# EAGLE design bombclock_1.2 (EAGLE 7.3.0)
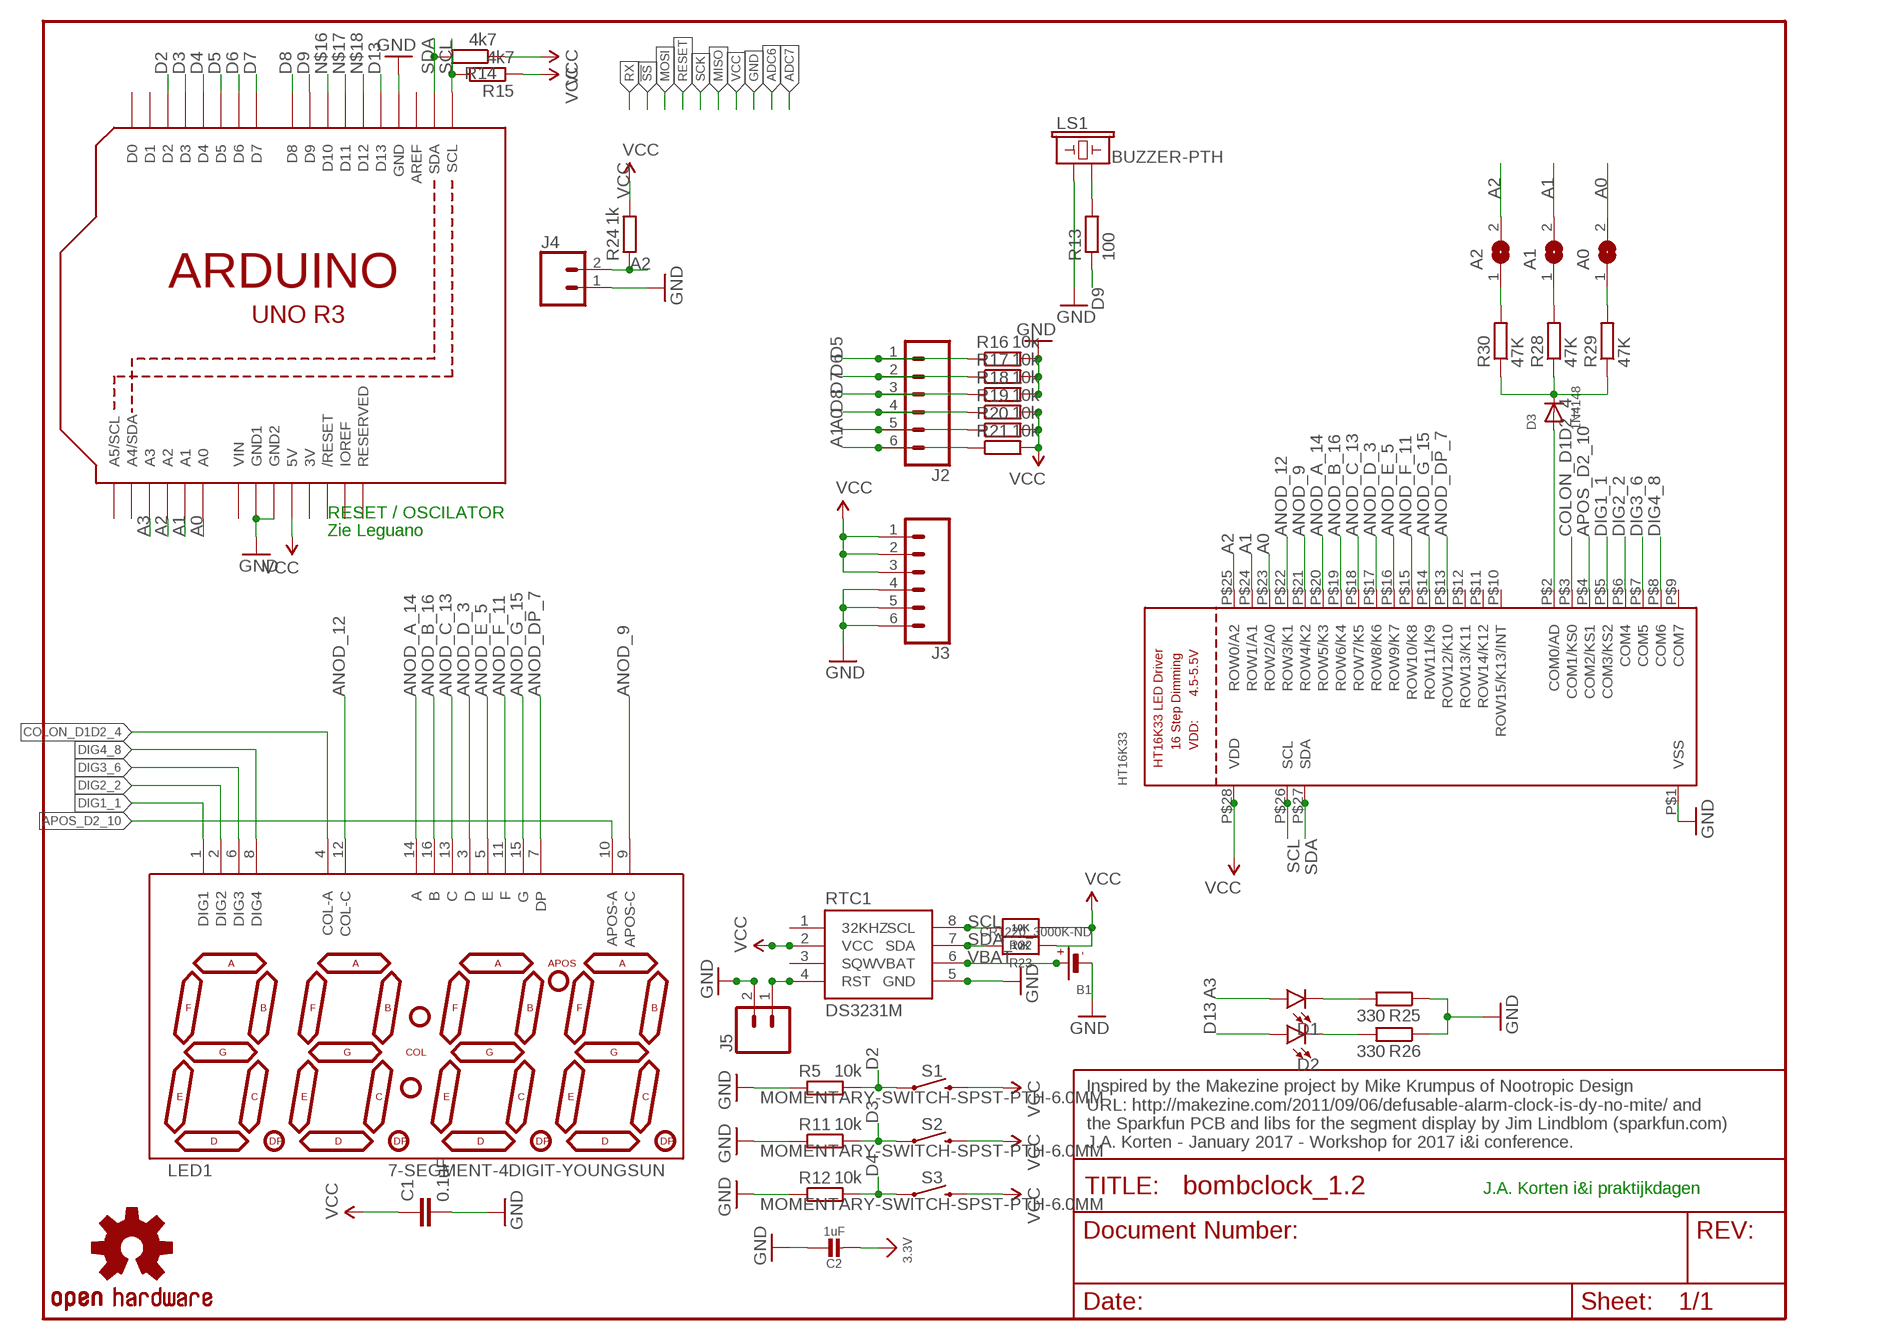
[diagram p0: schematic, sheet 1]

## Parts
A0  SOLDERJUMPERREFLOW_NOPASTE  [SOLDERJUMPER_REFLOW_NOPASTE]
A1  SOLDERJUMPERREFLOW_NOPASTE  [SOLDERJUMPER_REFLOW_NOPASTE]
A2  SOLDERJUMPERREFLOW_NOPASTE  [SOLDERJUMPER_REFLOW_NOPASTE]
B1  CR1220_3000K-ND  BATTERYCR1220_SMT  [CR1220]
C1  0.1uF  CAP0402-CAP  [0402-CAP]
C2  1uF  CAP_CERAMIC0805-NOOUTLINE  [0805-NO]
D1  LED5MM  [LED_5MM]
D2  LED5MM  [LED_5MM]
D3  1N4148  DIODESOD-323F  [SOD-323F]
HT16K33  HT16K33_SOP28  [SOP28_300MIL]
J2  CONN_06SILK_FEMALE_PTH  [1X06]
J3  CONN_06SILK_FEMALE_PTH  [1X06]
J4  CONN_02  [1X02]
J5  CONN_02  [1X02]
LED1  7-SEGMENT-4DIGIT-YOUNGSUN  [7-SEGMENT-4DIGIT-YOUNGSUN]
LS1  BUZZER-PTH  [BUZZER-12MM]
R5  10k  R-EU_R0603  [R0603]
R11  10k  R-EU_R0603  [R0603]
R12  10k  R-EU_R0603  [R0603]
R13  100  R-EU_R0603  [R0603]
R14  4k7  R-EU_R0603  [R0603]
R15  4k7  R-EU_R0603  [R0603]
R16  10k  R-EU_R0603  [R0603]
R17  10k  R-EU_R0603  [R0603]
R18  10k  R-EU_R0603  [R0603]
R19  10k  R-EU_R0603  [R0603]
R20  10k  R-EU_R0603  [R0603]
R21  10k  R-EU_R0603  [R0603]
R22  10K  RESISTOR0805_NOOUTLINE  [0805-NO]
R23  10K  RESISTOR0805_NOOUTLINE  [0805-NO]
R24  1k  R-EU_R0603  [R0603]
R25  330  R-EU_R0603  [R0603]
R26  330  R-EU_R0603  [R0603]
R28  47K  R-EU_R0603  [R0603]
R29  47K  R-EU_R0603  [R0603]
R30  47K  R-EU_R0603  [R0603]
RTC1  DS3231M  [SO08]
S1  MOMENTARY-SWITCH-SPST-PTH-6.0MM  [TACTILE_SWITCH_PTH_6.0MM]
S2  MOMENTARY-SWITCH-SPST-PTH-6.0MM  [TACTILE_SWITCH_PTH_6.0MM]
S3  MOMENTARY-SWITCH-SPST-PTH-6.0MM  [TACTILE_SWITCH_PTH_6.0MM]
U1  ARDUINOR3-DIMENSION  [ARDUINOR3]
U$4  OSHW-LOGOS  [OSHW-LOGO-S]

## Nets
3.3V: C2.2
A0: A0.2 HT16K33.P$23(ROW2/A0) J2.5 R20.1 U1.A0
A1: A1.2 HT16K33.P$24(ROW1/A1) J2.6 R21.1 U1.A1
A2: A2.2 HT16K33.P$25(ROW0/A2) J4.2 R24.1 U1.A2
A3: D1.A U1.A3
ANOD_9: HT16K33.P$21(ROW4/K2) LED1.9(APOS-C)
ANOD_12: HT16K33.P$22(ROW3/K1) LED1.12(COL-C)
ANOD_A_14: HT16K33.P$20(ROW5/K3) LED1.14(A)
ANOD_B_16: HT16K33.P$19(ROW6/K4) LED1.16(B)
ANOD_C_13: HT16K33.P$18(ROW7/K5) LED1.13(C)
ANOD_D_3: HT16K33.P$17(ROW8/K6) LED1.3(D)
ANOD_DP_7: HT16K33.P$13(ROW12/K10) LED1.7(DP)
ANOD_E_5: HT16K33.P$16(ROW9/K7) LED1.5(E)
ANOD_F_11: HT16K33.P$15(ROW10/K8) LED1.11(F)
ANOD_G_15: HT16K33.P$14(ROW11/K9) LED1.15(G)
APOS_D2_10: HT16K33.P$4(COM2/KS1) LED1.10(APOS-A)
COLON_D1D2_4: HT16K33.P$3(COM1/KS0) LED1.4(COL-A)
D2: R5.2 S1.1 U1.D2
D3: R11.2 S2.1 U1.D3
D4: R12.2 S3.1 U1.D4
D5: J2.1 R16.1 U1.D5
D6: J2.2 R17.1 U1.D6
D7: J2.3 R18.1 U1.D7
D8: J2.4 R19.1 U1.D8
D9: R13.1 U1.D9
D13: D2.A U1.D13
DIG1_1: HT16K33.P$5(COM3/KS2) LED1.1(DIG1)
DIG2_2: HT16K33.P$6(COM4) LED1.2(DIG2)
DIG3_6: HT16K33.P$7(COM5) LED1.6(DIG3)
DIG4_8: HT16K33.P$8(COM6) LED1.8(DIG4)
GND: B1.- C1.2 C2.1 HT16K33.P$1(VSS) J3.4 J3.5 J3.6 J4.1 J5.2 LS1.+ R5.1 R11.1 R12.1 R16.2 R17.2 R18.2 R25.1 R26.1 RTC1.5(GND) U1.GND U1.GND1 U1.GND2
N$1: A0.1 R29.2
N$7: D3.A HT16K33.P$2(COM0/AD)
N$12: D1.K(C) R25.2
N$14: D2.K(C) R26.2
N$16: U1.D10
N$17: U1.D11
N$18: U1.D12
N$19: A1.1 R28.2
N$20: LS1.- R13.2
N$28: D3.C R28.1 R29.1 R30.1
N$29: A2.1 R30.2
PP: J5.1 RTC1.4(RST)
SCL: HT16K33.P$26(SCL) R15.2 R22.2 RTC1.8(SCL) U1.SCL
SDA: HT16K33.P$27(SDA) R14.2 R23.2 RTC1.7(SDA) U1.SDA
VBAT: B1.+$1(+) RTC1.6(VBAT)
VCC: C1.1 HT16K33.P$28(VDD) J3.1 J3.2 J3.3 R14.1 R15.1 R19.2 R20.2 R21.2 R22.1 R23.1 R24.2 RTC1.2(VCC) S1.3 S2.3 S3.3 U1.5V
Unconnected: HT16K33.P$9(COM7) HT16K33.P$10(ROW15/K13/INT) HT16K33.P$11(ROW14/K12) HT16K33.P$12(ROW13/K11) RTC1.1(32KHZ) RTC1.3(SQW) U1.A4(A4/SDA) U1.A5(A5/SCL) U1.AREF U1.D0 U1.D1 U1.IOREF U1.RESERVED U1.RESET(/RESET)

## Notes on the sheet
- RESET / OSCILATOR
- Zie Leguano
- Inspired by the Makezine project by Mike Krumpus of Nootropic Design 
  URL: http://makezine.com/2011/09/06/defusable-alarm-clock-is-dy-no-mite/ and 
  the Sparkfun PCB and libs for the segment display by Jim Lindblom (sparkfun.com)
  J.A. Korten - January 2017 - Workshop for 2017 i&i conference.
- J.A. Korten i&i praktijkdagen

## Power pins joined to a net without a drawn wire
3V: U1.3V
VIN: U1.VIN

## Library data of the parts
A0 A1 A2 = microbuilder:SOLDERJUMPER: SMD Solder JUMPER Solder the two pads together to create a connection, or remove the solder to break it. REFLOW - Use this footprint for solder paste and reflow ovens. WAVE - Use this footprint for hand-soldering (larger pads). CLOSED - Has a trace between the two pads to ensure it is closed by default. The trace needs to be cut to disable the jumper, and can be closed again by creating a solder bridge between the two pads.
B1 = microbuilder:BATTERY: CR1220 SMT - Digikey: 3001K-ND CD2032 BAT-HLD-001 - Digikey: BAT-HLD-001-ND
C1 = SparkFun:CAP: Capacitor Standard 0603 ceramic capacitor, and 0.1" leaded capacitor.
C2 = microbuilder:CAP_CERAMIC: Ceramic Capacitors For new designs, use the packages preceded by an '_' character since they are more reliable: The following footprints should be used on most boards: _0402 - Standard footprint for regular board layouts _0603 - Standard footprint for regular board layouts _0805 - Standard footprint for regular board layouts _1206 - Standard footprint for regular board layouts For extremely tight-pitch boards where space is at a premium, the following 'micro-pitch' footprints can be used (smaller pads, no silkscreen outline, etc.): _0402MP - Micro-pitch footprint for very dense/compact boards _0603MP - Micro-pitch footprint for very dense/compact boards _0805MP - Micro-pitch footprint for very dense/compact boards _1206MP - Micro-pitch footprint for very dense/compact boards
D1 D2 = SparkFun-LED:LED: LED (Generic) Standard schematic elements and footprints for 5mm, 3mm, 1206, and 0603 sized LEDs. Generic LEDs with no color specified.
D3 = adafruit:DIODE: Diode SMADIODE - SMA Surface Mount Package 20V 1A Schottky Diode Digikey: 641-1014-6-ND DO-1N4148 - Through Hole Small Current Diode SOD-123 20V 1 A (.5mV Vf) Schottky Diode - Digikey: MBRX120TPMSCT-ND SOD-323 10V 570mA (.38mV Vf, 3ns) Schottky Diode - Digikey: ZLLS410CT-ND SOD-523 30V 30mA Schottky Diode (RB751S-40TE61) - Digikey: RB751S-40TE61CT-ND SOT23-R/W - SOT23 Package (R = Solder Paste/Reflow Ovens, W = Hand-Soldering) BAT54Film 40V 300mA - Digikey: 497-7162-1-ND
HT16K33 = microbuilder:HT16K33_SOP28
J2 J3 = SparkFun-Connectors:CONN_06: Multi connection point. Often used as Generic Header-pin footprint for 0.1 inch spaced/style header connections On any of the 0.1 inch spaced packages, you can populate with these: Break Away Headers - Straight <https://www.sparkfun.com/products/116> (PRT-00116) Break Away Male Headers - Right Angle <https://www.sparkfun.com/products/553> (PRT-00553) Female Headers <https://www.sparkfun.com/products/115> (PRT-00115) Break Away Headers - Machine Pin <https://www.sparkfun.com/products/117> (PRT-00117) Break Away Female Headers - Swiss Machine Pin <https://www.sparkfun.com/products/743> (PRT-00743) Arduino Stackable Header - 6 Pin <https://www.sparkfun.com/products/9280> (PRT-09280) For SCREWTERMINALS and SPRING TERMINALS visit here: Screw Terimnals on SparkFun.com <https://www.sparkfun.com/search/results?term=Screw+Terminals> (5mm/3.5mm/2.54mm spacing) This device is also useful as a general connection point to wire up your design to another part of your project. Our various solder wires solder well into these plated through hole pads. Hook-Up Wire - Assortment (Stranded, 22 AWG) <https://www.sparkfun.com/products/11375> (PRT-11375) Hook-Up Wire - Assortment (Solid Core, 22 AWG) <https://www.sparkfun.com/products/11367> (PRT-11367) View the entire wire category on our website here <https://www.sparkfun.com/categories/141>; PROD_ID: CONN-08437
J4 J5 = SparkFun-Connectors:CONN_02: Multi connection point. Often used as Generic Header-pin footprint for 0.1 inch spaced/style header connections On any of the 0.1 inch spaced packages, you can populate with these: Break Away Headers - Straight <https://www.sparkfun.com/products/116> (PRT-00116) Break Away Male Headers - Right Angle <https://www.sparkfun.com/products/553> (PRT-00553) Female Headers <https://www.sparkfun.com/products/115> (PRT-00115) Break Away Headers - Machine Pin <https://www.sparkfun.com/products/117> (PRT-00117) Break Away Female Headers - Swiss Machine Pin <https://www.sparkfun.com/products/743> (PRT-00743) For SCREWTERMINALS and SPRING TERMINALS visit here: Screw Terimnals on SparkFun.com <https://www.sparkfun.com/search/results?term=Screw+Terminals> (5mm/3.5mm/2.54mm spacing) This device is also useful as a general connection point to wire up your design to another part of your project. Our various solder wires solder well into these plated through hole pads. Hook-Up Wire - Assortment (Stranded, 22 AWG) <https://www.sparkfun.com/products/11375> (PRT-11375) Hook-Up Wire - Assortment (Solid Core, 22 AWG) <https://www.sparkfun.com/products/11367> (PRT-11367) View the entire wire category on our website here <https://www.sparkfun.com/categories/141> Special notes: Molex polarized connector foot print use with: PRT-08233 with associated crimp pins and housings. 2.54_SCREWTERM for use with PRT-10571. 3.5mm Screw Terminal footprints for PRT-08084 5mm Screw Terminal footprints for use with PRT-08432
LED1 = SparkFun:7-SEGMENT-4DIGIT-YOUNGSUN: This is a part for the 4-Digit 7-segment LEDs from Young Sun. Different from the Digikey LEDs, all 16 pins are used. The LONGPADS Variant is used for a test jig, but you may like it because there is more pad to solder to. If you are concerned about routing space, the standard works just fine though.
LS1 = SparkFun-Electromechanical:BUZZER: Buzzer Small round buzzers that operate around the audible 2kHz range. You can use these as speakers to create simple music or user interfaces. Variant Overview: PTH - Mini Speaker - PC Mount 12mm 2.048kHz <https://www.sparkfun.com/products/7950> PTH_KIT - Mini Speaker - PC Mount 12mm 2.048kHz <https://www.sparkfun.com/products/7950> KIT simplifies soldering by adding stop mask to one side of the pads. PTH_NO_SILK - Mini Speaker - PC Mount 12mm 2.048kHz <https://www.sparkfun.com/products/7950> No silkscreen indicator of buzzer outline. PTH_KIT_NO_SILK - Mini Speaker - PC Mount 12mm 2.048kHz <https://www.sparkfun.com/products/7950> KIT package w/o silkscreen SMD - Buzzer Audio Magnetic (CCV-084B16) SMD buzzer used on, e.g. the LilyPad Buzzer <https://www.sparkfun.com/products/8463> and RFID USB Reader <https://www.sparkfun.com/products/9963>. SMD_KIT - Buzzer Audio Magnetic (CCV-084B16) SMD Buzzer with elongated pins to make soldering easier. Used on the SparkFun Simon Says - Surface Mount Soldering Kit <https://www.sparkfun.com/products/10935>.; PROD_ID: COMP-08253; SF_SKU: COM-07950
R5 R11-R21 R24-R26 = rcl:R-EU_: RESISTOR, European symbol
R22 R23 = microbuilder:RESISTOR: Resistors For new designs, use the packages preceded by an '_' character since they are more reliable: The following footprints should be used on most boards: _0402 - Standard footprint for regular board layouts _0603 - Standard footprint for regular board layouts _0805 - Standard footprint for regular board layouts _1206 - Standard footprint for regular board layouts For extremely tight-pitch boards where space is at a premium, the following 'micro-pitch' footprints can be used (smaller pads, no silkscreen outline, etc.): _0402MP - Micro-pitch footprint for very dense/compact boards _0603MP - Micro-pitch footprint for very dense/compact boards _0805MP - Micro-pitch footprint for very dense/compact boards _1206MP - Micro-pitch footprint for very dense/compact boards
R28-R30 = resistor:R-EU_: RESISTOR, European symbol
RTC1 = SparkFun-Clocks:DS3231M: DS3231M Real Time Clock Accuracy +/-5ppm. Battery Backup. 2.3V to 5.5V. Datasheet <https://cdn.sparkfun.com/datasheets/Dev/Beagle/DS3231M.pdf> SparkFun Products CryptoCape <https://www.sparkfun.com/products/12773> (DEV-12773) SparkFun CryptoShield <https://www.sparkfun.com/products/13183> (DEV-13183); PROD_ID: IC-11985
S1-S3 = SparkFun-Switches:MOMENTARY-SWITCH-SPST: Momentary Switch (Pushbutton) - SPST Normally-open (NO) SPST momentary switches (buttons, pushbuttons). Variants PTH-12MM - 12mm square, through-hole Momentary Pushbutton Switch - 12mm Square <https://www.sparkfun.com/products/9190> (COM-09190) PTH-6.0MM, PTH-6.0MM-KIT - 6.0mm square, through-hole Mini Pushbutton Switch <https://www.sparkfun.com/products/97> (COM-00097) KIT package intended for soldering kit's - only one side of pads' copper is exposed. PTH-RIGHT-ANGLE-KIT - Right-angle, through-hole Right Angle Tactile Button <https://www.sparkfun.com/products/10791> - Used on SparkFun BigTime Watch Kit <https://www.sparkfun.com/products/11734> SMD-12MM - 12mm square, surface-mount Tactile Button - SMD (12mm) <https://www.sparkfun.com/products/12993> (COM-12993) Used on SparkFun PicoBoard <https://www.sparkfun.com/products/11888> SMD-4.5MM - 4.5mm Square Trackball Switch Used on SparkFun Blackberry Trackballer Breakout <https://www.sparkfun.com/products/13169> SMD-4.6MMX2.8MM - 4.60mm x 2.80mm, surface mount Used on SparkFun SAMD21 Mini Breakout <https://www.sparkfun.com/products/13664> SMD-5.2MM, SMD-5.2-REDUNDANT - 5.2mm square, surface-mount Mini Pushbutton Switch - SMD <https://www.sparkfun.com/products/8720> (COM-08720) Used on Arduino Pro Mini <https://www.sparkfun.com/products/11114> REDUNDANT package connects both switch circuits together SMD-6.0X3.5MM - 6.0 x 3.5mm, surface mount Momentary Reset Switch SMD <https://www.sparkfun.com/products/8229> (COM-08229) SMD-6.2MM-TALL - 6.2mm square, surface mount Tactile Button - SMD (6mm) <https://www.sparkfun.com/products/12992> Used on SparkFun Digital Sandbox <https://www.sparkfun.com/products/12651> SMD-RIGHT-ANGLE - Right-angle, surface mount Used on SparkFun Block for Intel® Edison - Arduino <https://www.sparkfun.com/products/13036>; PROD_ID: SWCH-08441; SF_SKU: COM-00097
U1 = adafruit:ARDUINOR3: This is a new object for the new Arduino R3 - with extra pins that you may want to use (such as IOref, and duplicated A4/A5
U$4 = SparkFun-Aesthetics:OSHW-LOGO: Open Source Hardware Logo This logo indicates the piece of hardware it is found on incorporates a OSHW license and/or adheres to the definition of open source hardware found here: http://freedomdefined.org/OSHW

## Board
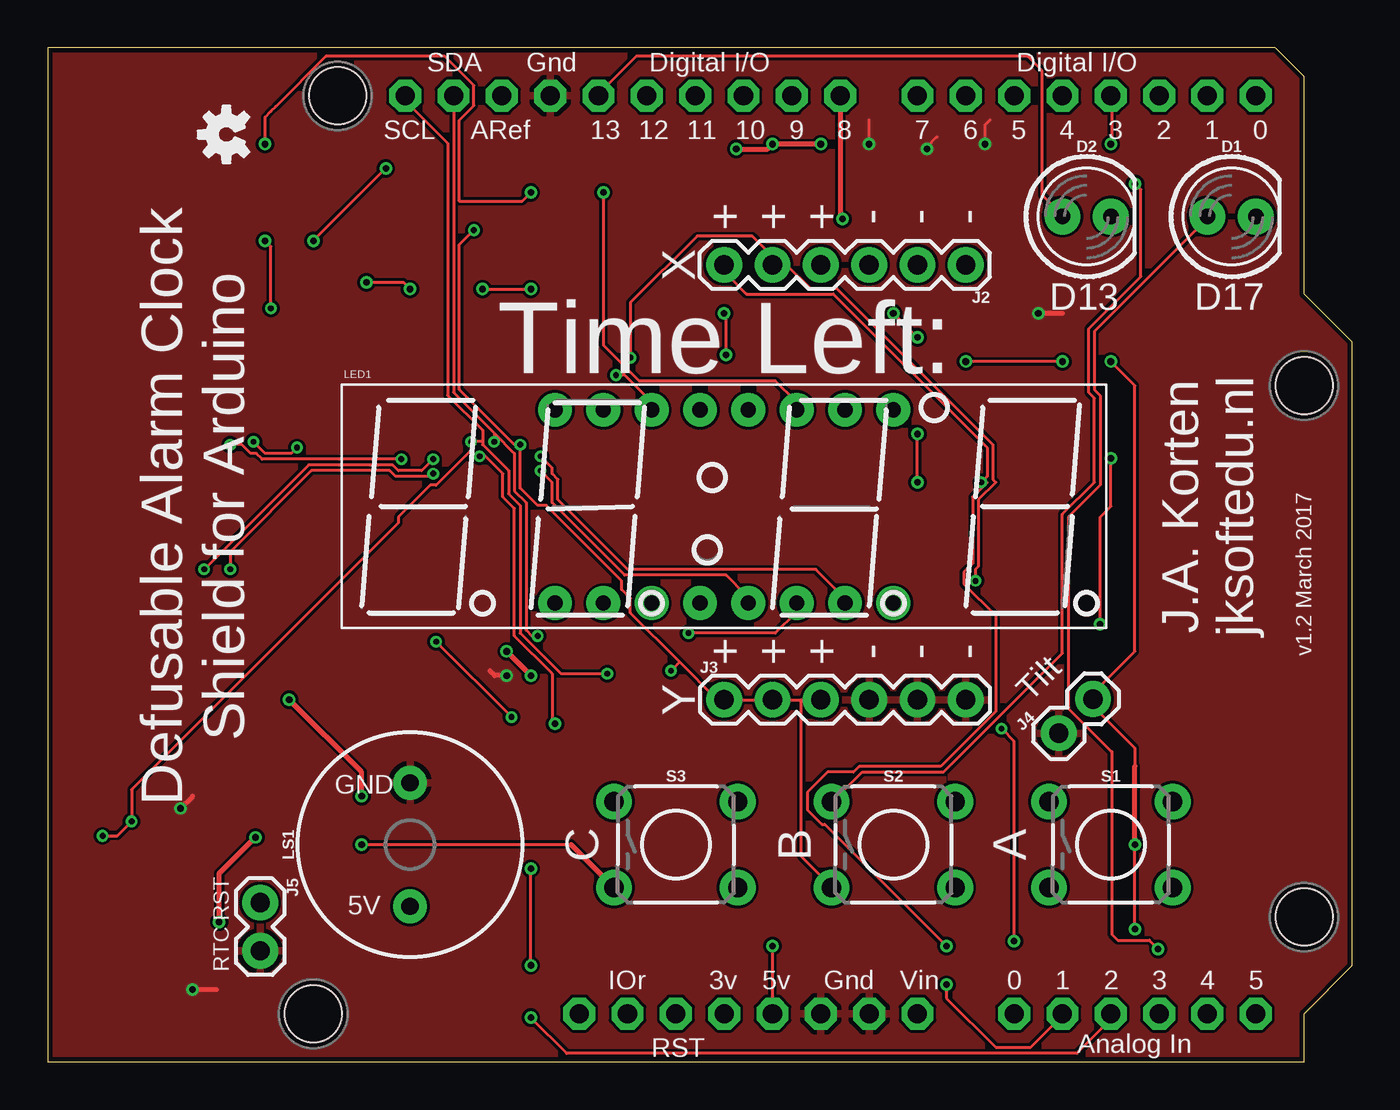
[diagram p1: board, top side]
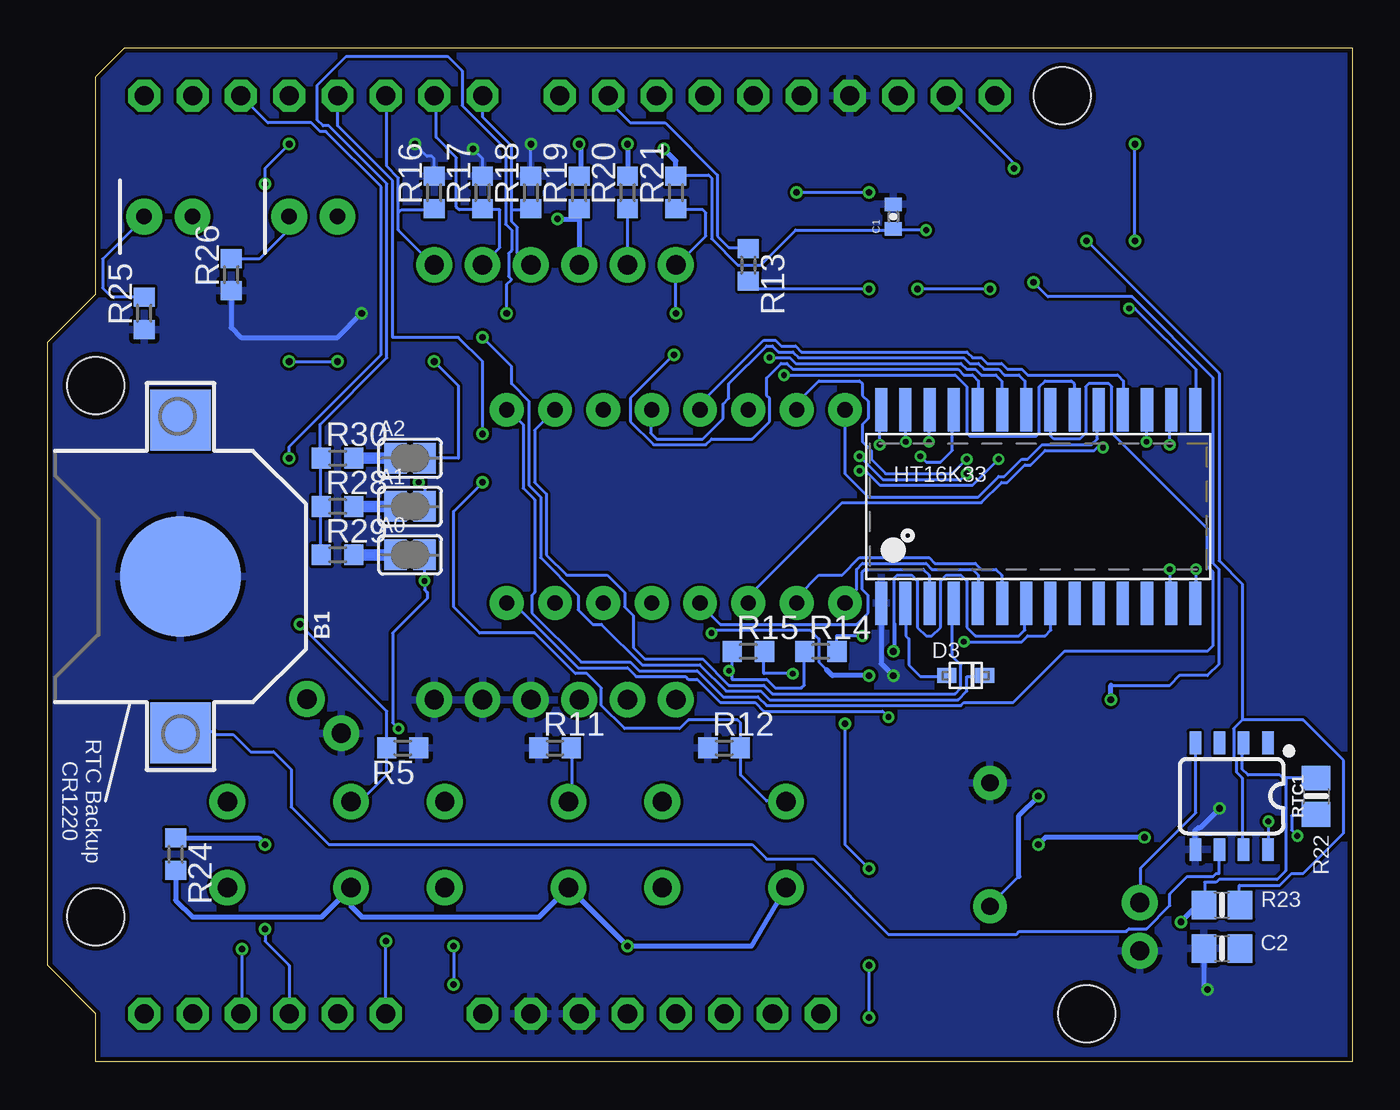
[diagram p2: board, bottom side, seen from below]

Size 68.58 x 53.34 mm. Coordinates in mm from the lower left corner, seen from the top.
Copper layers (1*16): Top 0.035mm / dielectric 1.5mm / Bottom 0.035mm
Design rules "ITEADstudioDRC": minimum track width 6mil, minimum drill 12mil, track to track 6mil, track to pad 6mil, pad to pad 6mil, via to via 6mil, smd to smd 0mil, copper to edge 10mil, drill to drill 10mil, minimum pad ring 10mil, minimum via ring 6mil, stop-mask expansion 2mil, vias tented up to drill 100mil, thermal gap 10mil
Holes 3 mm at 66.04,35.56 66.04,7.62 15.24,50.8 13.97,2.54

### Footprints (pad centres in the part's own frame; a part is rotated, then mirrored left to right if it is on the bottom)
SOLDERJUMPER_REFLOW_NOPASTE = smd 1.168 x 1.6: 1 -0.762,0; 2 0.762,0
CR1220 = smd 3.2 x 3.2: +$1 -8.225,0; +$2 8.225,0 | smd 6.35 x 6.35: - 0,0
0402-CAP = smd 0.7 x 0.9: 1 -0.65,0; 2 0.65,0
0805-NO = smd 1.3 x 1.5: 1 -0.95,0; 2 0.95,0
LED_5MM = drill 0.813 pad 1.88: A -1.27,0; K 1.27,0
SOD-323F = smd 1 x 0.8: A -1,0; C 1,0
SOP28_300MIL = smd 0.635 x 2.286: P$1 -8.255,-5.08; P$2 -6.985,-5.08; P$3 -5.715,-5.08; P$4 -4.445,-5.08; P$5 -3.175,-5.08; P$6 -1.905,-5.08; P$7 -0.635,-5.08; P$8 0.635,-5.08; P$9 1.905,-5.08; P$10 3.175,-5.08; P$11 4.445,-5.08; P$12 5.715,-5.08; P$13 6.985,-5.08; P$14 8.255,-5.08; P$15 8.255,5.08; P$16 6.985,5.08; P$17 5.715,5.08; P$18 4.445,5.08; P$19 3.175,5.08; P$20 1.905,5.08; P$21 0.635,5.08; P$22 -0.635,5.08; P$23 -1.905,5.08; P$24 -3.175,5.08; P$25 -4.445,5.08; P$26 -5.715,5.08; P$27 -6.985,5.08; P$28 -8.255,5.08
1X06 = drill 1.016 pad 1.88: 1 0,0; 2 2.54,0; 3 5.08,0; 4 7.62,0; 5 10.16,0; 6 12.7,0
1X02 = drill 1.016 pad 1.88: 1 0,0; 2 2.54,0
7-SEGMENT-4DIGIT-YOUNGSUN = drill 0.8 pad 1.778: 1 -8.89,-5.08; 2 -6.35,-5.08; 3 -3.81,-5.08; 4 -1.27,-5.08; 5 1.27,-5.08; 6 3.81,-5.08; 7 6.35,-5.08; 8 8.89,-5.08; 9 8.89,5.08; 10 6.35,5.08; 11 3.81,5.08; 12 1.27,5.08; 13 -1.27,5.08; 14 -3.81,5.08; 15 -6.35,5.08; 16 -8.89,5.08
BUZZER-12MM = drill 0.9 pad 1.778: + 3.25,0; - -3.25,0
R0603 = smd 1 x 1.1: 1 -0.85,0; 2 0.85,0
SO08 = smd 0.6 x 1.2: 1 -1.905,-2.8; 2 -0.635,-2.8; 3 0.635,-2.8; 4 1.905,-2.8; 5 1.905,2.8; 6 0.635,2.8; 7 -0.635,2.8; 8 -1.905,2.8
TACTILE_SWITCH_PTH_6.0MM = drill 1.016 pad 1.88: 1 -3.251,2.261; 2 3.251,2.261; 3 -3.251,-2.261; 4 3.251,-2.261
ARDUINOR3 = drill 1 pad 1.676 octagon: 3V 35.56,2.54; 5V 38.1,2.54; A0 50.8,2.54; A1 53.34,2.54; A2 55.88,2.54; A3 58.42,2.54; A4 60.96,2.54; A5 63.5,2.54; AREF 23.876,50.8; D0 63.5,50.8; D1 60.96,50.8; D2 58.42,50.8; D3 55.88,50.8; D4 53.34,50.8; D5 50.8,50.8; D6 48.26,50.8; D7 45.72,50.8; D8 41.656,50.8; D9 39.116,50.8; D10 36.576,50.8; D11 34.036,50.8; D12 31.496,50.8; D13 28.956,50.8; GND 26.416,50.8; GND1 43.18,2.54; GND2 40.64,2.54; IOREF 30.48,2.54; RESERVED 27.94,2.54; RESET 33.02,2.54; SCL 18.796,50.8; SDA 21.336,50.8; VIN 45.72,2.54

### Placement (x,y rotation side)
A0  49.53,26.67 0 bottom
A1  49.53,29.21 0 bottom
A2  49.53,31.75 0 bottom
B1  61.59,25.53 90 bottom
C1  24.13,44.45 90 bottom
C2  6.86,5.97 0 bottom
D1  62.23,44.45 0 top
D2  54.61,44.45 0 top
D3  20.32,20.32 0 bottom
HT16K33  16.51,29.21 0 bottom
J2  48.26,41.91 180 top
J3  35.56,19.05 0 top
J4  53.14,17.29 45 top
J5  11.18,8.38 270 top
LED1  35.56,29.21 0 top
LS1  19.05,11.43 90 top
R5  49.91,16.51 180 bottom
R11  41.91,16.51 0 bottom
R12  33.02,16.51 0 bottom
R13  31.75,41.91 270 bottom
R14  27.94,21.59 0 bottom
R15  31.75,21.59 0 bottom
R16  48.26,45.72 90 bottom
R17  45.72,45.72 90 bottom
R18  43.18,45.72 90 bottom
R19  40.64,45.72 90 bottom
R20  38.1,45.72 90 bottom
R21  35.56,45.72 90 bottom
R22  1.91,13.97 270 bottom
R23  6.86,8.26 0 bottom
R24  61.85,10.92 270 bottom
R25  63.5,39.37 90 bottom
R26  58.93,41.4 90 bottom
R28  53.34,29.21 0 bottom
R29  53.34,26.67 0 bottom
R30  53.34,31.75 0 bottom
RTC1  6.35,13.97 180 bottom
S1  55.88,11.43 0 top
S2  44.45,11.43 0 top
S3  33.02,11.43 0 top
U1  0,0 0 top
U$4  9.4,48.77 90 top

### Tracks (layer width: path | path; a pad name or v marks a point on that pad's centre or on a via)
A0  (via drill 0.3, 0.35)
  Top 0.152: v48.77,25.3 48.77,25.91 48.92,26.06 48.92,29.57 49.84,30.48 49.68,30.63 49.68,32.46 41.45,40.69 40.08,40.69 38.86,41.91 J2.5 38.1,42.37 37.03,43.43 34.14,43.43 30.63,39.93 v30.63,37.03 | v50.14,17.53 50.8,16.87 v50.8,6.35
  Bottom 0.152: J2.5 R20.1 | A0.2 v48.77,25.3 48.77,24.84 48.62,24.69 48.62,24.38 50.44,22.55 50.44,17.83 v50.14,17.53 | v30.63,37.03 29.57,37.03 29.26,36.73 20.57,36.73 20.27,36.42 19.81,36.42 19.51,36.12 18.75,36.12 18.44,35.81 18.44,34.29 HT16K33.P$23 | U1.A0 v50.8,6.35
A1  (via drill 0.3, 0.35)
  Top 0.152: 49.23,30.63 49.38,30.79 49.38,32.31 41.3,40.39 36.73,40.39 35.66,41.45 35.66,41.91 J2.6 | v47.24,6.1 40.84,12.5 40.69,12.5 39.93,13.26 39.93,14.17 41,15.24 42.37,15.24 42.67,15.54 46.94,15.54 49.84,18.44 49.84,23.47 48.16,25.15 48.16,25.76 48.62,26.21 48.62,29.72 49.38,30.48 49.23,30.63 | U1.A1 53.34,2.44 51.66,0.76 49.84,0.76 47.24,3.35 v47.24,4.06 | 49.23,30.63 v49.07,30.48 | v35.66,37.19 35.66,39.27 v35.56,39.37
  Bottom 0.152: R21.1 35.51,44.81 34.14,44.81 33.98,44.65 33.98,43.43 35.51,41.91 J2.6 | A1.2 48.77,30.18 v49.07,30.48 | v35.66,37.19 37.95,34.9 37.95,33.68 36.73,32.46 33.98,32.46 33.68,32.77 31.55,32.77 30.63,33.68 30.63,34.9 30.79,35.05 30.79,35.97 30.02,36.73 29.72,36.73 29.41,36.42 20.73,36.42 20.42,36.12 19.96,36.12 19.66,35.81 19.66,34.29 HT16K33.P$24 | 35.66,41.91 J2.6 | v35.56,39.37 J2.6 | v47.24,6.1 v47.24,4.06
A2  (via drill 0.3, 0.35)
  Top 0.152: v22.71,31.85 23.01,31.85 23.93,30.94 23.93,29.72 24.54,29.11 24.54,22.4 26.52,20.42 26.52,17.93 v26.67,17.78 | U1.A2 55.78,2.44 55.78,2.13 54.1,0.46 27.28,0.46 v25.4,2.34 | v57.15,6.99 v57.15,11.43 | v55.88,36.83 57.15,35.56 57.15,21.59 54.94,19.38 J4.2 55.02,19.05 55.02,18.64 57.15,16.51 57.15,15.54 | v53.34,36.83 v48.26,36.83 | v25.4,5.08 v25.4,10.16
  Top 0.254: v57.15,11.43 57.15,15.54
  Bottom 0.152: v22.71,31.85 22.4,31.55 21.64,31.55 21.03,32.16 21.03,34.29 HT16K33.P$25 | v55.88,36.83 v53.34,36.83 | v48.26,36.83 46.99,35.56 46.99,31.75 A2.2 | v57.15,6.99 57.15,6.35 55.88,5.08 U1.A2 | v26.67,17.78 26.67,11.43 v25.4,10.16 | v25.4,2.34 v25.4,5.08
  Bottom 0.254: R24.1 57.49,11.77 v57.15,11.43
A3  (via drill 0.35)
  Top 0.152: v58.37,5.94 57.91,6.4 56.24,6.4 55.93,6.71 55.93,16.31 53.65,18.59 53.65,28.65 55.32,30.33 55.32,35.05 55.02,35.36 55.02,38.41 60.96,44.35 D1.A | 58.37,2.59 U1.A3
  Bottom 0.152: v58.37,5.94 58.37,2.59 U1.A3
ANOD_9
  Bottom 0.152: HT16K33.P$21 15.85,34.29 15.85,32.92 15.7,32.77 14.33,32.77 14.02,33.07 14.02,35.51 13.87,35.66 12.8,35.66 12.65,35.51 12.65,33.07 7.62,28.04 7.62,26.06 7.32,25.76 7.32,21.89 7.62,21.59 15.14,21.59 17.83,18.9 20.42,18.9 20.57,18.75 30.79,18.75 31.24,19.2 33.07,19.2 34.44,20.57 37.49,20.57 37.95,21.03 40.54,21.03 43.13,23.62 43.13,24.54 42.98,24.69 42.98,29.57 43.59,30.18 43.59,33.53 44.35,34.29 LED1.9
ANOD_12
  Bottom 0.152: HT16K33.P$22 17.22,34.29 17.22,35.81 17.53,36.12 18.29,36.12 18.59,36.42 19.36,36.42 19.66,36.73 20.12,36.73 20.42,37.03 29.11,37.03 29.41,37.34 30.18,37.34 30.48,37.64 30.79,37.64 32.77,35.66 32.77,34.9 33.07,34.59 33.07,33.83 34.14,32.77 36.58,32.77 36.88,33.07 36.88,34.29 LED1.12
ANOD_A_14  (via drill 0.3)
  Top 0.152: v29.87,36.12 30.33,36.12 31.7,34.75 31.7,34.29 LED1.14
  Bottom 0.152: v29.87,36.12 20.88,36.12 20.27,35.51 20.27,33.07 20.12,32.92 16.61,32.92 16.46,33.07 16.46,35.51 16.15,35.81 14.78,35.81 14.63,35.66 14.63,34.29 HT16K33.P$20
ANOD_B_16
  Bottom 0.152: LED1.16 26.67,30.94 25.45,29.72 19.66,29.72 18.59,30.79 18.29,30.79 17.37,31.7 17.07,31.7 16.31,32.46 13.72,32.46 13.41,32.77 13.41,34.29 HT16K33.P$19
ANOD_C_13
  Bottom 0.152: LED1.13 34.29,34.59 30.94,37.95 30.33,37.95 30.02,37.64 29.26,37.64 28.96,37.34 20.27,37.34 19.96,37.03 19.51,37.03 19.2,36.73 18.44,36.73 18.14,36.42 17.37,36.42 17.07,36.12 12.34,36.12 12.04,35.81 12.04,34.29 HT16K33.P$18
ANOD_D_3  (via drill 0.3)
  Top 0.152: v10.82,32.61 11.43,32 12.8,32 v13.11,32.31
  Bottom 0.152: v10.82,32.61 10.82,34.29 HT16K33.P$17 | v13.11,32.31 13.41,32.31 13.56,32.16 16.15,32.16 16.92,31.39 17.22,31.39 18.14,30.48 18.44,30.48 19.51,29.41 26.82,29.41 31.7,24.54 31.7,24.23 LED1.3
ANOD_DP_7  (via drill 0.3)
  Top 0.152: v9.6,25.91 9.6,26.82 13.87,31.09 17.98,31.09 18.29,30.79 20.12,30.79 v20.27,30.94 | v25.91,31.85 26.52,31.24 26.52,30.94 26.82,30.63 26.82,29.57 30.48,25.91 40.39,25.91 41.91,24.38 LED1.7
  Bottom 0.152: v9.6,25.91 9.6,24.23 HT16K33.P$13 | v20.27,30.94 20.57,30.63 24.69,30.63 v25.91,31.85
ANOD_E_5  (via drill 0.3)
  Top 0.152: v9.6,32.46 10.21,32.46 10.67,32 10.97,32 11.28,31.7 v18.59,31.7 | v25.91,31.09 26.52,30.48 26.52,29.41 30.33,25.6 35.66,25.6 36.73,24.54 36.73,24.23 LED1.5
  Bottom 0.152: v9.6,32.46 9.6,34.29 HT16K33.P$16 | v18.59,31.7 19.96,30.33 24.84,30.33 25.6,31.09 v25.91,31.09
ANOD_F_11  (via drill 0.3, 0.35)
  Top 0.152: LED1.11 39.32,34.29 39.32,34.75 38.25,35.81 31.09,35.81 29.21,37.69 v29.21,45.72 | v25.4,45.72 24.94,45.26 21.64,45.26 21.64,49.53 22.4,50.29 22.4,51.36 20.88,52.88 14.63,52.88 11.99,50.24 11.73,49.99 11.43,49.68 v11.43,48.26 | v11.73,39.62 11.73,42.88 v11.43,43.18
  Bottom 0.152: v11.73,39.62 11.43,39.62 8.23,36.42 8.23,34.29 HT16K33.P$15 | v25.4,45.72 v29.21,45.72 | v11.43,43.18 v11.43,48.26
ANOD_G_15  (via drill 0.3)
  Top 0.152: v8.23,25.91 13.72,31.39 18.14,31.39 18.44,31.09 19.66,31.09 v20.27,31.7
  Bottom 0.152: v8.23,25.91 8.23,24.23 HT16K33.P$14 | v20.27,31.7 21.03,30.94 24.54,30.94 25.3,31.7 25.3,32.16 25.76,32.61 25.76,33.53 25.45,33.83 25.45,34.75 25.76,35.05 25.76,35.66 25.91,35.81 28.04,35.81 29.11,34.75 29.11,34.29 LED1.15
APOS_D2_10
  Bottom 0.152: LED1.10 42.98,33.22 42.98,30.48 42.37,29.87 42.37,26.67 41.3,25.6 39.17,25.6 38.25,24.69 38.25,23.93 37.8,23.47 37.8,21.79 37.19,21.18 34.14,21.18 32.77,19.81 30.94,19.81 30.48,19.36 20.88,19.36 20.57,19.66 20.57,20.88 21.03,21.34 21.03,24.08 HT16K33.P$4
COLON_D1D2_4
  Bottom 0.152: HT16K33.P$3 22.25,24.23 22.25,25.6 22.55,25.91 25.6,25.91 25.76,25.76 25.76,24.84 25.45,24.54 25.45,23.62 26.06,23.01 33.22,23.01 34.29,24.08 LED1.4
D2  (via drill 0.35)
  Top 0.152: v55.32,23.01 55.32,28.65 55.88,29.21 v55.88,31.75
  Bottom 0.152: S1.1 52.58,13.72 52.12,13.72 50.75,15.09 50.75,16.46 R5.2 50.75,16.61 50.75,18.44 v55.32,23.01 | U1.D2 57,49.38 54.71,49.38 54.25,48.92 53.95,48.92 51.05,46.02 51.05,37.19 54.91,33.33 55.32,32.92 55.88,32.36 v55.88,31.75
D3  (via drill 0.35)
  Top 0.152: U1.D3 55.93,50.75 55.93,48.31 v55.88,48.26 | S2.1 41.3,13.72 42.82,15.24 47.09,15.24 53.34,21.49 53.34,28.8 55.02,30.48 55.02,34.9 54.71,35.2 54.71,38.56 57.45,41.3 57.45,45.87 v57.15,46.18
  Bottom 0.152: R11.2 41,16.46 41,13.87 41.15,13.72 S2.1 | v55.88,48.26 57.15,46.99 v57.15,46.18
D4  (via drill 0.35)
  Top 0.152: v45.72,30.48 v45.72,33.02
  Bottom 0.152: S3.1 29.87,13.72 30.79,13.72 32.16,15.09 32.16,16.46 R12.2 32.16,16.61 32.16,17.83 32.31,17.98 34.9,17.98 35.36,17.53 38.25,17.53 39.47,18.75 39.47,19.66 40.23,20.42 40.84,20.42 42.98,22.55 45.87,22.55 47.24,23.93 47.24,28.96 v45.72,30.48 | U1.D4 53.34,49.23 50.44,46.33 50.44,38.1 46.99,38.1 45.72,36.83 v45.72,33.02
D5
  Bottom 0.152: 50.14,44.65 49.99,44.81 48.31,44.81 R16.1 | 50.14,44.65 50.14,43.74 48.31,41.91 J2.1 | 50.14,44.65 50.14,46.48 50.75,47.09 50.75,50.75 U1.D5
D6
  Bottom 0.152: 45.72,44.81 44.81,44.81 44.81,42.82 J2.2 | 45.72,44.81 46.94,44.81 47.09,44.96 47.09,47.55 48.16,48.62 48.16,50.75 U1.D6 | 45.72,44.81 R17.1
D7
  Bottom 0.152: 44.2,44.81 43.28,44.81 R18.1 | 44.2,44.81 44.2,44.2 43.89,43.89 43.89,42.52 43.28,41.91 J2.3 | U1.D7 45.72,49.68 44.2,48.16 44.2,44.81
D8  (via drill 0.35)
  Top 0.254: U1.D8 41.66,44.45 v41.78,44.32
  Bottom 0.254: R19.1 40.64,44.45 | 40.64,44.45 J2.4 | v41.78,44.32 40.77,44.32 40.64,44.45
D9
  Bottom 0.152: R13.1 31.85,42.82 32.77,42.82 33.38,43.43 33.38,46.63 36.12,49.38 37.95,49.38 39.01,50.44 39.01,50.75 U1.D9
D13
  Top 0.152: U1.D13 28.96,50.9 30.94,52.88 51.51,52.88 52.27,52.12 52.27,45.57 53.34,44.5 D2.A
DIG1_1
  Bottom 0.152: HT16K33.P$5 19.66,24.23 19.66,25.6 19.96,25.91 22.1,25.91 22.4,26.21 25.76,26.21 26.06,25.91 26.06,24.84 26.67,24.23 LED1.1
DIG2_2
  Bottom 0.152: HT16K33.P$6 18.44,24.23 18.44,25.6 18.75,25.91 19.51,25.91 19.81,26.21 21.95,26.21 22.25,26.52 25.91,26.52 26.82,25.6 28.04,25.6 29.11,24.54 29.11,24.23 LED1.2
DIG3_6  (via drill 0.3, 0.35)
  Top 0.152: v33.68,22.55 38.25,22.55 39.32,23.62 39.32,24.08 LED1.6
  Top 0.254: v24.13,21.59 v25.4,20.32
  Bottom 0.152: 24.08,23.01 24.08,25.45 23.93,25.6 23.16,25.6 22.86,25.3 22.86,22.86 22.4,22.4 22.1,22.4 21.64,22.86 21.64,25.3 21.34,25.6 20.57,25.6 20.27,25.3 20.27,22.86 19.81,22.4 17.53,22.4 17.22,22.71 17.22,24.08 HT16K33.P$7 | 27.43,20.42 27.64,20.62 28.04,21.03 28.04,22.25 28.5,22.71 33.53,22.71 v33.68,22.55
  Bottom 0.21: 24.08,23.01 24.08,21.64
  Bottom 0.254: 24.08,21.64 v24.13,21.59 | v25.4,20.32 27.33,20.32 27.64,20.62
DIG4_8  (via drill 0.3)
  Top 0.152: v24.38,18.14 v20.42,22.1
  Bottom 0.152: v20.42,22.1 17.37,22.1 17.07,22.4 16.15,22.4 15.85,22.71 15.85,24.08 HT16K33.P$8 | v24.38,18.14 24.69,18.44 30.94,18.44 31.39,18.9 33.22,18.9 34.44,20.12 34.9,20.12 35.05,20.27 37.64,20.27 38.1,20.73 40.69,20.73 44.04,24.08 44.35,24.08 LED1.8
GND  (via drill 0.35)
  Top 0.152: v43.18,48.26 43.18,49.53 | v49.28,48.26 49.28,49.28 49.53,49.53 | v46.23,48.01 46.23,48.13 46.74,48.64
  Top 0.254: v24.13,20.32 23.5,20.32 23.24,20.57 | v52.07,39.37 53.34,39.37 | v7.62,3.81 8.89,3.81 | v6.99,13.34 7.62,13.97
  Bottom 0.152: R18.2 v43.18,48.26 | R16.2 48.26,47.5 48.39,47.62 48.64,47.62 v49.28,48.26 | R17.2 45.72,47.5 v46.23,48.01
  Bottom 0.254: HT16K33.P$1 24.77,20.95 v24.13,20.32 | R26.1 58.93,38.61 58.42,38.1 53.34,38.1 v52.07,39.37 | C2.1 7.81,4 v7.62,3.81 | RTC1.5 8.26,12.19 8.13,12.32 8,12.32 v6.99,13.34
  pour Bottom: 0,53.34 68.58,53.34 68.58,0 0,0
  pour Top: 0,0 0,53.34 68.58,53.34 68.58,0
N$1
  Bottom 0.61: A0.1 R29.2
N$7
  Bottom 0.152: D3.A 21.34,20.27 22.71,20.27 23.32,20.88 23.32,22.25 23.47,22.4 23.47,24.08 HT16K33.P$2
N$12
  Bottom 0.152: R25.2 63.55,40.23 65.23,40.23 65.68,40.69 65.68,42.22 63.55,44.35 D1.K
N$14
  Bottom 0.152: R26.2 58.83,42.22 57.45,42.22 55.93,43.74 55.93,44.35 D2.K
N$19
  Bottom 0.61: A1.1 R28.2
N$20  (via drill 0.35)
  Top 0.152: v16.76,41 18.69,41 v19.05,40.64 | v22.86,40.64 v25.4,40.64
  Top 0.254: v16.51,13.97 16.51,15.24 v12.7,19.05
  Bottom 0.152: v16.76,41 16,40.23 11.58,40.23 7.32,35.97 7.32,26.21 7.01,25.91 7.01,20.93 7.62,20.32 9.09,20.32 9.6,19.81 12.7,19.81 | 17.53,9.75 19.05,8.23 LS1.- | 31.7,41 R13.2 31.33,40.64 v25.4,40.64 | v19.05,40.64 v22.86,40.64
  Bottom 0.254: 17.53,9.75 17.53,12.95 v16.51,13.97 | v12.7,19.05 12.7,19.81
N$28  (via drill 0.35)
  Top 0.152: v45.72,38.1 v44.45,39.37
  Bottom 0.152: R29.1 54.25,26.67 54.25,29.11 R28.1 54.25,29.26 54.25,31.7 R30.1 54.25,31.85 54.25,33.53 50.75,37.03 50.75,46.18 53.8,49.23 54.1,49.23 54.41,49.53 54.41,51.36 52.88,52.88 47.55,52.88 46.79,52.12 46.79,50.29 44.5,48.01 44.5,44.04 44.2,43.74 44.2,42.67 44.35,42.52 44.35,41.3 44.2,41.15 44.45,40.89 v44.45,39.37 | D3.C 19.36,20.27 20.27,20.27 20.27,19.51 20.73,19.05 30.63,19.05 31.09,19.51 32.92,19.51 34.29,20.88 37.34,20.88 39.47,23.01 39.93,23.01 40.69,23.77 40.69,24.54 42.67,26.52 42.67,29.72 43.28,30.33 43.28,34.75 44.2,35.66 44.2,36.58 v45.72,38.1
N$29
  Bottom 0.61: A2.1 R30.2
PP
  Bottom 0.152: RTC1.4 8.23,16.76 8.23,13.11 11.12,10.21 11.12,8.38 J5.1
SCL  (via drill 0.3)
  Top 0.152: v2.9,11.89 3.66,11.89 v4.42,12.65 4.42,14.33 18.44,28.35 18.44,28.65 20.12,30.33 20.42,30.33 22.25,32.16 v22.25,32.61 22.86,32.61 | v29.41,20.42 26.98,20.42 24.84,22.55 24.84,29.26 24.23,29.87 24.23,31.09 22.86,32.46 22.86,32.61 | 22.86,32.61 22.86,33.22 21.03,35.05 21.03,48.31 18.9,50.44 18.9,50.75 U1.SCL
  Bottom 0.152: v4.42,12.65 4.42,11.28 RTC1.8 | v2.9,11.89 3.2,12.19 3.2,12.95 1.98,12.95 R22.2 | v29.41,20.42 30.94,20.42 30.94,21.49 R15.2 | v22.25,32.61 22.25,34.29 HT16K33.P$26
SDA  (via drill 0.3, 0.35)
  Top 0.152: v25.76,22.4 25.45,22.4 25.15,22.71 25.15,29.41 24.54,30.02 24.54,32 23.47,33.07 | 23.47,33.07 21.34,35.2 U1.SDA | 23.47,33.07 v23.47,32.61 | v13.97,43.18 v17.78,46.99
  Bottom 0.152: 5.79,17.98 6.25,17.53 6.25,16 6.1,15.85 6.1,15.24 5.79,14.94 5.79,11.28 RTC1.7 | 5.79,17.98 2.59,17.98 0.46,15.85 0.46,12.04 2.59,9.91 3.2,9.91 3.81,9.3 5.94,9.3 5.94,8.38 R23.2 | v25.76,22.4 27.13,22.4 27.13,21.64 R14.2 | v23.47,32.61 23.47,34.29 HT16K33.P$27 | 5.79,17.98 5.79,25.15 7.01,26.36 7.01,36.22 v13.97,43.18 | 21.34,50.44 U1.SDA 17.78,47.24 v17.78,46.99
VBAT
  Bottom 0.152: RTC1.6 7.01,11.12 7.01,9.91 7.16,9.91 7.32,9.75 8.69,9.75 9.6,8.84 9.6,8.23 10.82,7.01 11.73,7.01 11.89,6.86 17.53,6.86 17.68,6.71 24.38,6.71 28.35,10.67 30.79,10.67 31.55,11.43 53.8,11.43 55.78,13.41 55.78,15.39 56.69,16.31 57.91,16.31 58.83,17.22 59.74,17.22 59.89,17.37 61.57,17.37 B1.+$1
VCC  (via drill 0.3, 0.35)
  Top 0.152: 24.84,32.16 24.84,30.18 25.76,29.26 26.21,29.26 30.18,25.3 30.18,24.84 30.63,24.38 30.63,23.62 33.22,21.03 | 24.84,32.16 v24.84,32.46 | 33.22,21.03 35.2,19.05 J3.1 J3.2 39.62,19.05 | 33.22,21.03 v32.77,20.57 | 39.62,19.05 J3.3 | v22.4,43.74 21.64,42.98 21.64,35.36 24.84,32.16 | v38.1,6.1 U1.5V | 39.62,19.05 39.62,10.82 41.15,9.3 S2.3 | v16.51,11.43 27.51,11.43
  Top 0.254: v9.02,7.37 9.02,9.91 v10.92,11.81 | 27.51,11.43 S3.3 | v40.64,48.26 v38.1,48.26 37.85,48.01 v36.2,48.01
  Bottom 0.152: 35.66,46.63 R21.2 35.51,46.63 33.83,46.63 33.68,46.48 33.68,43.28 32.31,41.91 31.09,41.91 29.26,43.74 24.23,43.74 C1.1 24.08,43.74 v22.4,43.74 | 40.54,46.63 R19.2 | 38.1,46.63 R20.2 | 32.61,20.57 32.61,21.49 R15.1 | 32.61,20.57 32.61,20.12 30.79,20.12 30.33,19.66 28.96,19.66 28.8,19.81 28.8,21.49 R14.1 | v24.84,32.46 24.84,34.29 HT16K33.P$28 | v32.77,20.57 32.61,20.57 | 3.5,14.94 1.98,14.94 R22.1 | 3.5,14.94 3.66,14.94 3.81,15.09 5.49,15.09 5.79,15.39 5.79,16.76 RTC1.2 | 3.5,14.94 3.5,10.06 3.96,9.6 7.01,9.6 7.16,9.45 7.77,9.45 7.77,8.38 R23.1
  Bottom 0.254: R24.2 61.85,8.51 60.96,7.62 54.18,7.62 S1.3 52.63,8.18 52.07,7.62 42.75,7.62 S2.3 38.12,6.1 v38.1,6.1 31.57,6.1 S3.3 | R23.1 8.13,8.26 v9.02,7.37 | v10.92,11.81 16.13,11.81 v16.51,11.43 | 40.54,46.63 40.54,48.16 v40.64,48.26 | v38.1,48.26 R20.2 | R21.2 35.56,47.37 v36.2,48.01

### Text on the board
_tsilk: + | + | + | - | - | - | X | D13 | D17 | Time Left: | Defusable Alarm Clock / Shield for Arduino | J.A. Korten / jksoftedu.nl | v1.2 March 2017 | + | + | + | - | - | - | Tilt | Y | GND | C | B | A | 5V | RTC RST
_bsilk: RTC Backup / CR1220